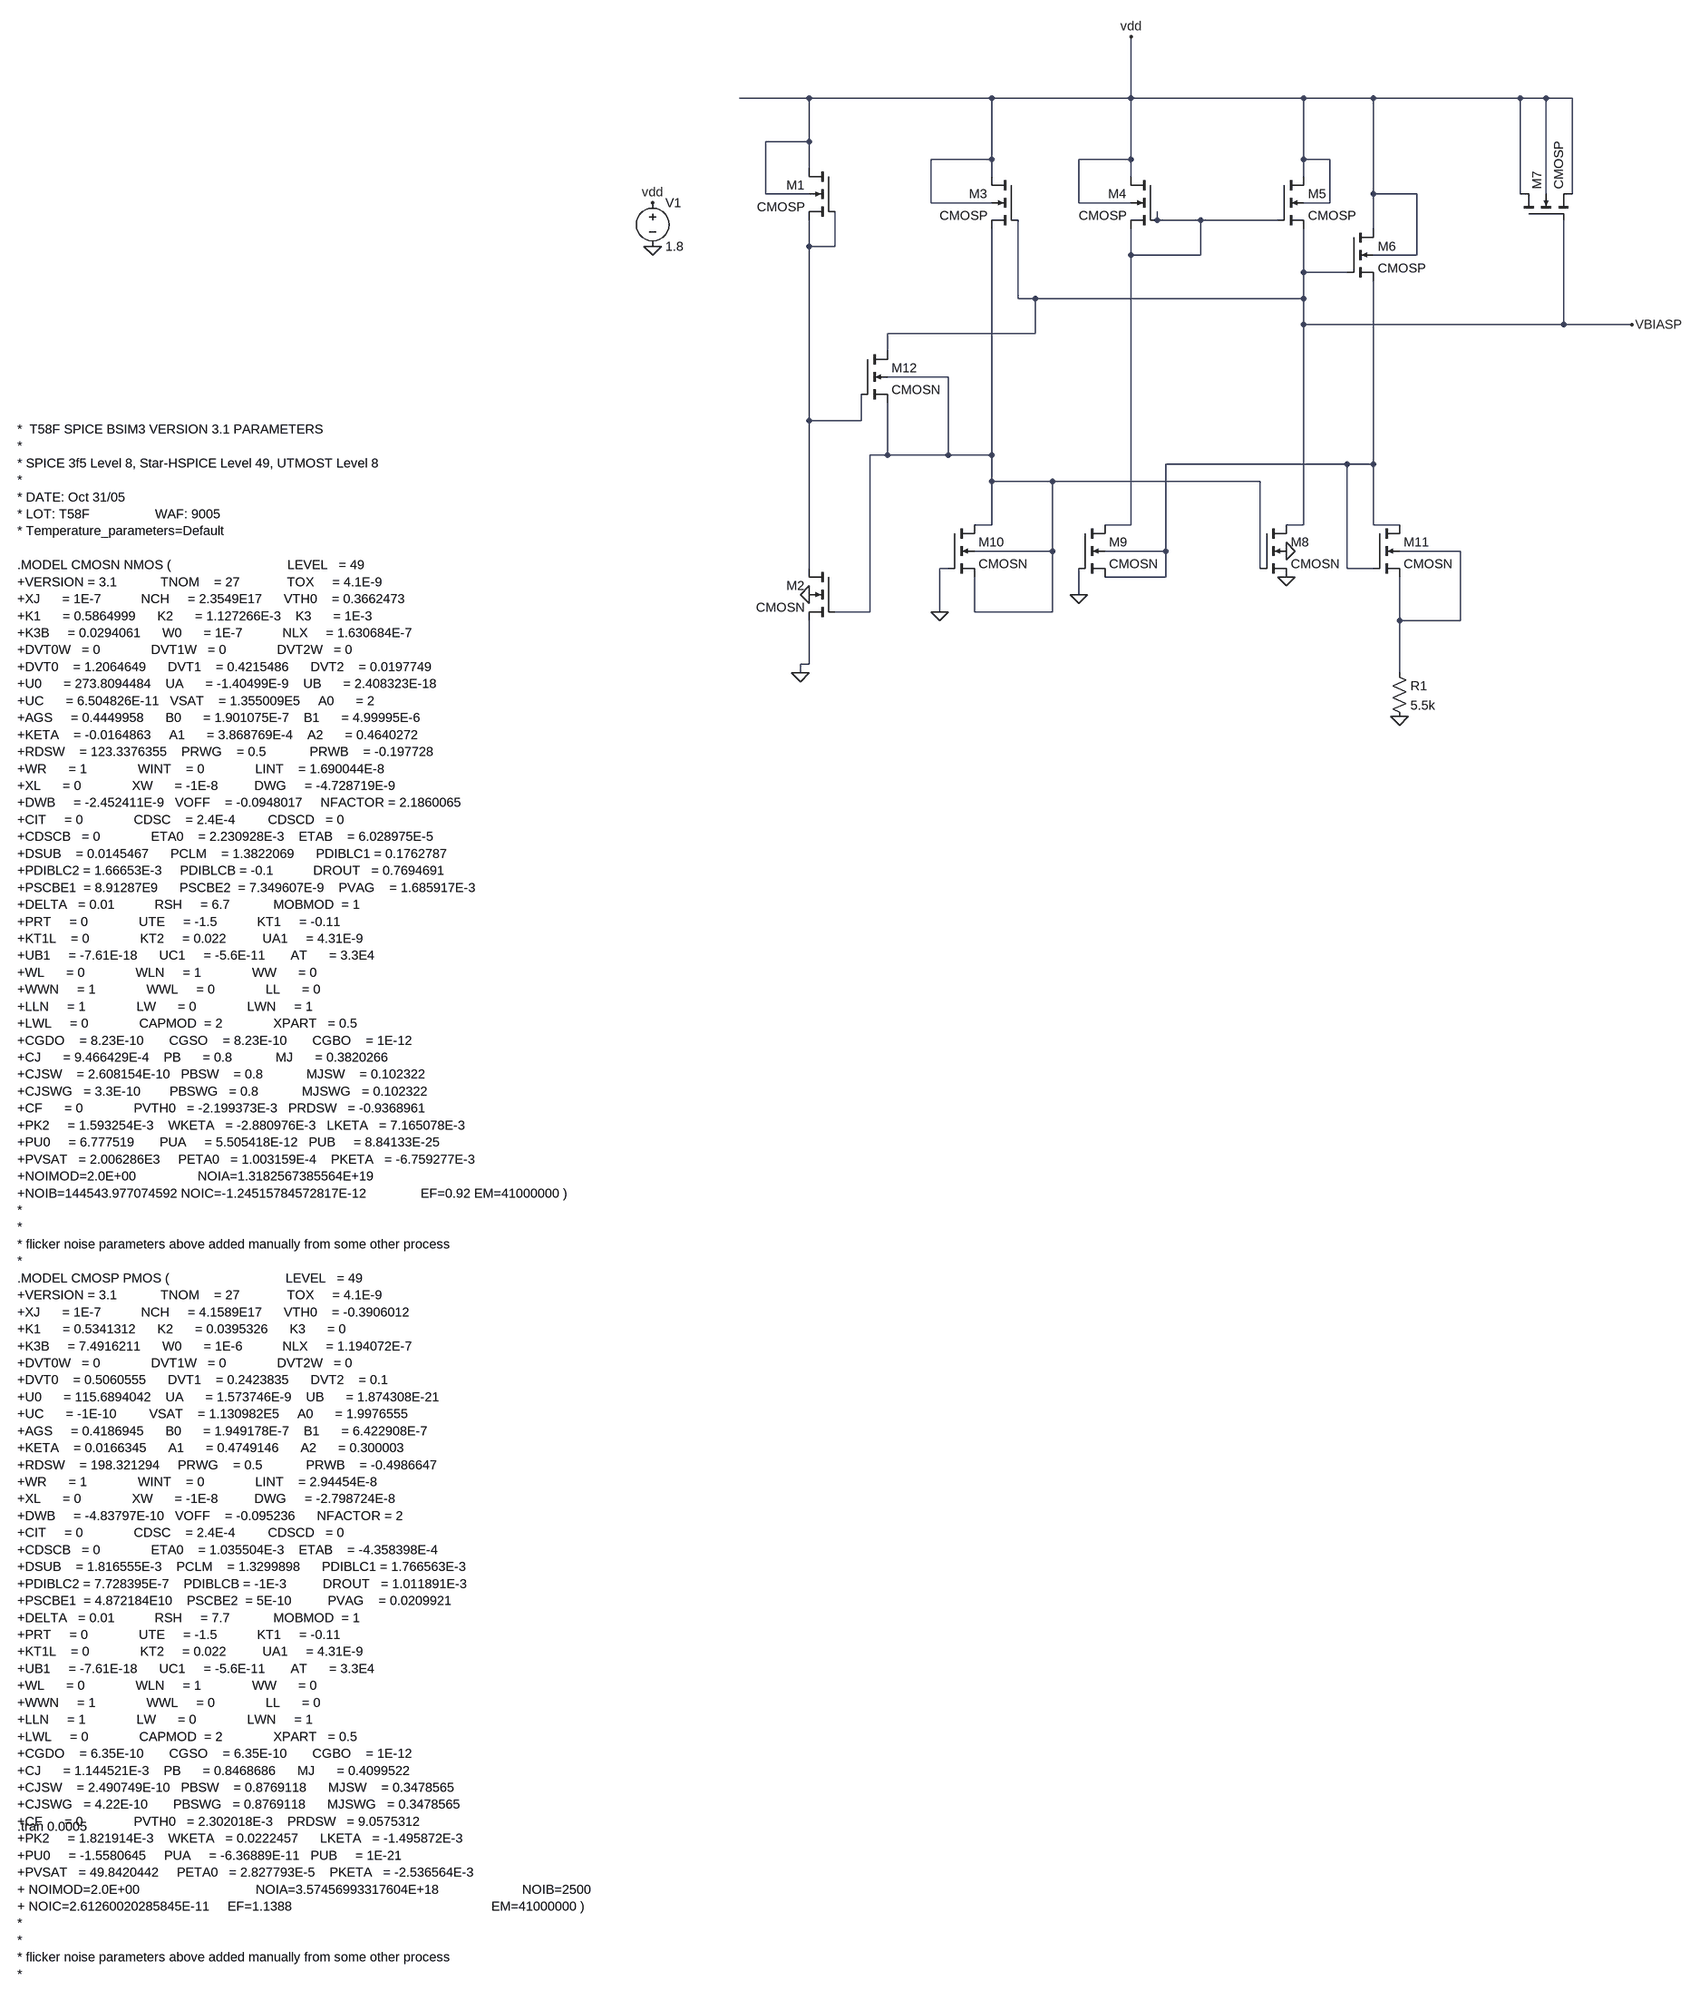
[diagram p0: schematic betamultiply.asc]
betamultiply.asc, the LTspice schematic file:
Version 4
SHEET 1 1480 2616
WIRE -432 -576 -560 -576
WIRE -96 -576 -432 -576
WIRE 160 -576 160 -736
WIRE 160 -576 -96 -576
WIRE 496 -576 160 -576
WIRE 624 -576 496 -576
WIRE 912 -576 624 -576
WIRE 960 -576 912 -576
WIRE 1008 -576 960 -576
WIRE -432 -496 -432 -576
WIRE -432 -496 -512 -496
WIRE -96 -464 -96 -576
WIRE -96 -464 -208 -464
WIRE 160 -464 160 -576
WIRE 160 -464 64 -464
WIRE 496 -464 496 -576
WIRE 544 -464 496 -464
WIRE -432 -448 -432 -496
WIRE -96 -432 -96 -464
WIRE 160 -432 160 -464
WIRE 496 -432 496 -464
WIRE -512 -400 -512 -496
WIRE -432 -400 -512 -400
WIRE 624 -400 624 -576
WIRE 704 -400 624 -400
WIRE 912 -400 912 -576
WIRE 960 -400 960 -576
WIRE 1008 -400 1008 -576
WIRE -208 -384 -208 -464
WIRE -96 -384 -208 -384
WIRE 64 -384 64 -464
WIRE 160 -384 64 -384
WIRE 544 -384 544 -464
WIRE 544 -384 496 -384
WIRE 208 -352 208 -368
WIRE 288 -352 208 -352
WIRE 448 -352 288 -352
WIRE 624 -336 624 -400
WIRE -432 -304 -432 -352
WIRE -384 -304 -384 -368
WIRE -384 -304 -432 -304
WIRE 160 -288 160 -336
WIRE 288 -288 288 -352
WIRE 288 -288 160 -288
WIRE 704 -288 704 -400
WIRE 704 -288 624 -288
WIRE 496 -256 496 -336
WIRE 576 -256 496 -256
WIRE -48 -208 -48 -352
WIRE -16 -208 -48 -208
WIRE 496 -208 496 -256
WIRE 496 -208 -16 -208
WIRE 496 -160 496 -208
WIRE 992 -160 992 -352
WIRE 992 -160 496 -160
WIRE 1376 -160 992 -160
WIRE -16 -144 -16 -208
WIRE -16 -144 -288 -144
WIRE -288 -112 -288 -144
WIRE -176 -64 -288 -64
WIRE -432 16 -432 -304
WIRE -336 16 -336 -32
WIRE -336 16 -432 16
WIRE -288 80 -288 -16
WIRE -288 80 -320 80
WIRE -176 80 -176 -64
WIRE -176 80 -288 80
WIRE -96 80 -96 -336
WIRE -96 80 -176 80
WIRE 576 96 224 96
WIRE 624 96 624 -240
WIRE 624 96 576 96
WIRE -96 128 -96 80
WIRE 16 128 -96 128
WIRE 416 128 16 128
WIRE -96 208 -96 128
WIRE -96 208 -128 208
WIRE 160 208 160 -288
WIRE 160 208 112 208
WIRE 496 208 496 -160
WIRE 496 208 464 208
WIRE 624 208 624 96
WIRE 672 208 624 208
WIRE 16 256 16 128
WIRE 16 256 -128 256
WIRE 224 256 224 96
WIRE 224 256 112 256
WIRE 784 256 672 256
WIRE -432 288 -432 16
WIRE -176 288 -192 288
WIRE 416 288 416 128
WIRE 576 288 576 96
WIRE 624 288 576 288
WIRE 224 304 224 256
WIRE 224 304 112 304
WIRE 64 336 64 288
WIRE -320 368 -320 80
WIRE -320 368 -384 368
WIRE -192 368 -192 288
WIRE -128 368 -128 304
WIRE 16 368 16 256
WIRE 16 368 -128 368
WIRE 672 384 672 304
WIRE 784 384 784 256
WIRE 784 384 672 384
WIRE -432 464 -432 384
WIRE -432 464 -448 464
WIRE -448 480 -448 464
WIRE 672 480 672 384
FLAG 672 560 0
FLAG 464 304 0
FLAG 64 336 0
FLAG -192 368 0
FLAG -448 480 0
FLAG -432 336 0
FLAG -928 -304 0
FLAG -928 -384 vdd
FLAG 1376 -160 VBIASP
FLAG 160 -736 vdd
FLAG 464 256 0
SYMBOL nmos4 -384 -448 M0
SYMATTR InstName M1
SYMATTR Value CMOSP
SYMATTR Value2 l=2u w=24u
SYMBOL nmos4 -384 288 M0
SYMATTR InstName M2
SYMATTR Value CMOSN
SYMATTR Value2 l=2u w=10u
SYMBOL nmos4 -48 -432 M0
SYMATTR InstName M3
SYMATTR Value CMOSP
SYMATTR Value2 l=2u w=24u
SYMBOL nmos4 208 -432 M0
SYMATTR InstName M4
SYMATTR Value CMOSP
SYMATTR Value2 l=2u w=24u
SYMBOL nmos4 448 -432 R0
SYMATTR InstName M5
SYMATTR Value CMOSP
SYMATTR Value2 l=2u w=24u
SYMBOL nmos4 576 -336 R0
SYMATTR InstName M6
SYMATTR Value CMOSP
SYMATTR Value2 l=2u w=24u
SYMBOL nmos4 912 -352 R270
SYMATTR InstName M7
SYMATTR Value CMOSP
SYMATTR Value2 l=2u w=24u
SYMBOL nmos4 416 208 R0
SYMATTR InstName M8
SYMATTR Value CMOSN
SYMATTR Value2 l=2u w=10u
SYMBOL nmos4 64 208 R0
SYMATTR InstName M9
SYMATTR Value CMOSN
SYMATTR Value2 l=2u w=10u
SYMBOL nmos4 -176 208 R0
SYMATTR InstName M10
SYMATTR Value CMOSN
SYMATTR Value2 l=2u w=10u
SYMBOL nmos4 624 208 R0
SYMATTR InstName M11
SYMATTR Value CMOSN
SYMATTR Value2 l=2u w=10u
SYMBOL nmos4 -336 -112 R0
SYMATTR InstName M12
SYMATTR Value CMOSN
SYMATTR Value2 l=2u w=10u
SYMBOL res 656 464 R0
SYMATTR InstName R1
SYMATTR Value 5.5k
SYMBOL voltage -928 -400 R0
WINDOW 123 0 0 Left 0
WINDOW 39 0 0 Left 0
SYMATTR InstName V1
SYMATTR Value 1.8
TEXT -2096 32 Left 2 !*  T58F SPICE BSIM3 VERSION 3.1 PARAMETERS\n* \n* SPICE 3f5 Level 8, Star-HSPICE Level 49, UTMOST Level 8\n* \n* DATE: Oct 31/05\n* LOT: T58F                  WAF: 9005\n* Temperature_parameters=Default\n \n.MODEL CMOSN NMOS (                                LEVEL   = 49\n+VERSION = 3.1            TNOM    = 27             TOX     = 4.1E-9\n+XJ      = 1E-7           NCH     = 2.3549E17      VTH0    = 0.3662473\n+K1      = 0.5864999      K2      = 1.127266E-3    K3      = 1E-3\n+K3B     = 0.0294061      W0      = 1E-7           NLX     = 1.630684E-7\n+DVT0W   = 0              DVT1W   = 0              DVT2W   = 0\n+DVT0    = 1.2064649      DVT1    = 0.4215486      DVT2    = 0.0197749\n+U0      = 273.8094484    UA      = -1.40499E-9    UB      = 2.408323E-18\n+UC      = 6.504826E-11   VSAT    = 1.355009E5     A0      = 2\n+AGS     = 0.4449958      B0      = 1.901075E-7    B1      = 4.99995E-6\n+KETA    = -0.0164863     A1      = 3.868769E-4    A2      = 0.4640272\n+RDSW    = 123.3376355    PRWG    = 0.5            PRWB    = -0.197728\n+WR      = 1              WINT    = 0              LINT    = 1.690044E-8\n+XL      = 0              XW      = -1E-8          DWG     = -4.728719E-9\n+DWB     = -2.452411E-9   VOFF    = -0.0948017     NFACTOR = 2.1860065\n+CIT     = 0              CDSC    = 2.4E-4         CDSCD   = 0\n+CDSCB   = 0              ETA0    = 2.230928E-3    ETAB    = 6.028975E-5\n+DSUB    = 0.0145467      PCLM    = 1.3822069      PDIBLC1 = 0.1762787\n+PDIBLC2 = 1.66653E-3     PDIBLCB = -0.1           DROUT   = 0.7694691\n+PSCBE1  = 8.91287E9      PSCBE2  = 7.349607E-9    PVAG    = 1.685917E-3\n+DELTA   = 0.01           RSH     = 6.7            MOBMOD  = 1\n+PRT     = 0              UTE     = -1.5           KT1     = -0.11\n+KT1L    = 0              KT2     = 0.022          UA1     = 4.31E-9\n+UB1     = -7.61E-18      UC1     = -5.6E-11       AT      = 3.3E4\n+WL      = 0              WLN     = 1              WW      = 0\n+WWN     = 1              WWL     = 0              LL      = 0\n+LLN     = 1              LW      = 0              LWN     = 1\n+LWL     = 0              CAPMOD  = 2              XPART   = 0.5\n+CGDO    = 8.23E-10       CGSO    = 8.23E-10       CGBO    = 1E-12\n+CJ      = 9.466429E-4    PB      = 0.8            MJ      = 0.3820266\n+CJSW    = 2.608154E-10   PBSW    = 0.8            MJSW    = 0.102322\n+CJSWG   = 3.3E-10        PBSWG   = 0.8            MJSWG   = 0.102322\n+CF      = 0              PVTH0   = -2.199373E-3   PRDSW   = -0.9368961\n+PK2     = 1.593254E-3    WKETA   = -2.880976E-3   LKETA   = 7.165078E-3\n+PU0     = 6.777519       PUA     = 5.505418E-12   PUB     = 8.84133E-25\n+PVSAT   = 2.006286E3     PETA0   = 1.003159E-4    PKETA   = -6.759277E-3\n+NOIMOD=2.0E+00                 NOIA=1.3182567385564E+19\n+NOIB=144543.977074592 NOIC=-1.24515784572817E-12               EF=0.92 EM=41000000 )\n*\n*\n* flicker noise parameters above added manually from some other process\n* \n.MODEL CMOSP PMOS (                                LEVEL   = 49\n+VERSION = 3.1            TNOM    = 27             TOX     = 4.1E-9\n+XJ      = 1E-7           NCH     = 4.1589E17      VTH0    = -0.3906012\n+K1      = 0.5341312      K2      = 0.0395326      K3      = 0\n+K3B     = 7.4916211      W0      = 1E-6           NLX     = 1.194072E-7\n+DVT0W   = 0              DVT1W   = 0              DVT2W   = 0\n+DVT0    = 0.5060555      DVT1    = 0.2423835      DVT2    = 0.1\n+U0      = 115.6894042    UA      = 1.573746E-9    UB      = 1.874308E-21\n+UC      = -1E-10         VSAT    = 1.130982E5     A0      = 1.9976555\n+AGS     = 0.4186945      B0      = 1.949178E-7    B1      = 6.422908E-7\n+KETA    = 0.0166345      A1      = 0.4749146      A2      = 0.300003\n+RDSW    = 198.321294     PRWG    = 0.5            PRWB    = -0.4986647\n+WR      = 1              WINT    = 0              LINT    = 2.94454E-8\n+XL      = 0              XW      = -1E-8          DWG     = -2.798724E-8\n+DWB     = -4.83797E-10   VOFF    = -0.095236      NFACTOR = 2\n+CIT     = 0              CDSC    = 2.4E-4         CDSCD   = 0\n+CDSCB   = 0              ETA0    = 1.035504E-3    ETAB    = -4.358398E-4\n+DSUB    = 1.816555E-3    PCLM    = 1.3299898      PDIBLC1 = 1.766563E-3\n+PDIBLC2 = 7.728395E-7    PDIBLCB = -1E-3          DROUT   = 1.011891E-3\n+PSCBE1  = 4.872184E10    PSCBE2  = 5E-10          PVAG    = 0.0209921\n+DELTA   = 0.01           RSH     = 7.7            MOBMOD  = 1\n+PRT     = 0              UTE     = -1.5           KT1     = -0.11\n+KT1L    = 0              KT2     = 0.022          UA1     = 4.31E-9\n+UB1     = -7.61E-18      UC1     = -5.6E-11       AT      = 3.3E4\n+WL      = 0              WLN     = 1              WW      = 0\n+WWN     = 1              WWL     = 0              LL      = 0\n+LLN     = 1              LW      = 0              LWN     = 1\n+LWL     = 0              CAPMOD  = 2              XPART   = 0.5\n+CGDO    = 6.35E-10       CGSO    = 6.35E-10       CGBO    = 1E-12\n+CJ      = 1.144521E-3    PB      = 0.8468686      MJ      = 0.4099522\n+CJSW    = 2.490749E-10   PBSW    = 0.8769118      MJSW    = 0.3478565\n+CJSWG   = 4.22E-10       PBSWG   = 0.8769118      MJSWG   = 0.3478565\n+CF      = 0              PVTH0   = 2.302018E-3    PRDSW   = 9.0575312\n+PK2     = 1.821914E-3    WKETA   = 0.0222457      LKETA   = -1.495872E-3\n+PU0     = -1.5580645     PUA     = -6.36889E-11   PUB     = 1E-21\n+PVSAT   = 49.8420442     PETA0   = 2.827793E-5    PKETA   = -2.536564E-3 \n+ NOIMOD=2.0E+00                                NOIA=3.57456993317604E+18                       NOIB=2500\n+ NOIC=2.61260020285845E-11     EF=1.1388                                                       EM=41000000 )\n*\n*\n* flicker noise parameters above added manually from some other process\n*
TEXT -2096 2600 Left 2 !.tran 0.0005

The netlist it stands for:
* betamultiply.asc
M1 vdd N002 N002 vdd CMOSP l=2u w=24u
M2 N002 N003 0 0 CMOSN l=2u w=10u
M3 vdd VBIASP N003 vdd CMOSP l=2u w=24u
M4 vdd N001 N001 vdd CMOSP l=2u w=24u
M5 vdd N001 VBIASP vdd CMOSP l=2u w=24u
M6 vdd VBIASP N004 vdd CMOSP l=2u w=24u
M7 vdd VBIASP vdd vdd CMOSP l=2u w=24u
M8 VBIASP N003 0 0 CMOSN l=2u w=10u
M9 N001 0 N004 N004 CMOSN l=2u w=10u
M10 N003 0 N003 N003 CMOSN l=2u w=10u
M11 N004 N004 N005 N005 CMOSN l=2u w=10u
M12 VBIASP N002 N003 N003 CMOSN l=2u w=10u
R1 N005 0 5.5k
V1 vdd 0 1.8
.model NMOS NMOS
.model PMOS PMOS
.lib standard.mos
*  T58F SPICE BSIM3 VERSION 3.1 PARAMETERS
*
* SPICE 3f5 Level 8, Star-HSPICE Level 49, UTMOST Level 8
*
* DATE: Oct 31/05
* LOT: T58F                  WAF: 9005
* Temperature_parameters=Default
.MODEL CMOSN NMOS (                                LEVEL   = 49
+VERSION = 3.1            TNOM    = 27             TOX     = 4.1E-9
+XJ      = 1E-7           NCH     = 2.3549E17      VTH0    = 0.3662473
+K1      = 0.5864999      K2      = 1.127266E-3    K3      = 1E-3
+K3B     = 0.0294061      W0      = 1E-7           NLX     = 1.630684E-7
+DVT0W   = 0              DVT1W   = 0              DVT2W   = 0
+DVT0    = 1.2064649      DVT1    = 0.4215486      DVT2    = 0.0197749
+U0      = 273.8094484    UA      = -1.40499E-9    UB      = 2.408323E-18
+UC      = 6.504826E-11   VSAT    = 1.355009E5     A0      = 2
+AGS     = 0.4449958      B0      = 1.901075E-7    B1      = 4.99995E-6
+KETA    = -0.0164863     A1      = 3.868769E-4    A2      = 0.4640272
+RDSW    = 123.3376355    PRWG    = 0.5            PRWB    = -0.197728
+WR      = 1              WINT    = 0              LINT    = 1.690044E-8
+XL      = 0              XW      = -1E-8          DWG     = -4.728719E-9
+DWB     = -2.452411E-9   VOFF    = -0.0948017     NFACTOR = 2.1860065
+CIT     = 0              CDSC    = 2.4E-4         CDSCD   = 0
+CDSCB   = 0              ETA0    = 2.230928E-3    ETAB    = 6.028975E-5
+DSUB    = 0.0145467      PCLM    = 1.3822069      PDIBLC1 = 0.1762787
+PDIBLC2 = 1.66653E-3     PDIBLCB = -0.1           DROUT   = 0.7694691
+PSCBE1  = 8.91287E9      PSCBE2  = 7.349607E-9    PVAG    = 1.685917E-3
+DELTA   = 0.01           RSH     = 6.7            MOBMOD  = 1
+PRT     = 0              UTE     = -1.5           KT1     = -0.11
+KT1L    = 0              KT2     = 0.022          UA1     = 4.31E-9
+UB1     = -7.61E-18      UC1     = -5.6E-11       AT      = 3.3E4
+WL      = 0              WLN     = 1              WW      = 0
+WWN     = 1              WWL     = 0              LL      = 0
+LLN     = 1              LW      = 0              LWN     = 1
+LWL     = 0              CAPMOD  = 2              XPART   = 0.5
+CGDO    = 8.23E-10       CGSO    = 8.23E-10       CGBO    = 1E-12
+CJ      = 9.466429E-4    PB      = 0.8            MJ      = 0.3820266
+CJSW    = 2.608154E-10   PBSW    = 0.8            MJSW    = 0.102322
+CJSWG   = 3.3E-10        PBSWG   = 0.8            MJSWG   = 0.102322
+CF      = 0              PVTH0   = -2.199373E-3   PRDSW   = -0.9368961
+PK2     = 1.593254E-3    WKETA   = -2.880976E-3   LKETA   = 7.165078E-3
+PU0     = 6.777519       PUA     = 5.505418E-12   PUB     = 8.84133E-25
+PVSAT   = 2.006286E3     PETA0   = 1.003159E-4    PKETA   = -6.759277E-3
+NOIMOD=2.0E+00                 NOIA=1.3182567385564E+19
+NOIB=144543.977074592 NOIC=-1.24515784572817E-12               EF=0.92 EM=41000000 )
*
*
* flicker noise parameters above added manually from some other process
*
.MODEL CMOSP PMOS (                                LEVEL   = 49
+VERSION = 3.1            TNOM    = 27             TOX     = 4.1E-9
+XJ      = 1E-7           NCH     = 4.1589E17      VTH0    = -0.3906012
+K1      = 0.5341312      K2      = 0.0395326      K3      = 0
+K3B     = 7.4916211      W0      = 1E-6           NLX     = 1.194072E-7
+DVT0W   = 0              DVT1W   = 0              DVT2W   = 0
+DVT0    = 0.5060555      DVT1    = 0.2423835      DVT2    = 0.1
+U0      = 115.6894042    UA      = 1.573746E-9    UB      = 1.874308E-21
+UC      = -1E-10         VSAT    = 1.130982E5     A0      = 1.9976555
+AGS     = 0.4186945      B0      = 1.949178E-7    B1      = 6.422908E-7
+KETA    = 0.0166345      A1      = 0.4749146      A2      = 0.300003
+RDSW    = 198.321294     PRWG    = 0.5            PRWB    = -0.4986647
+WR      = 1              WINT    = 0              LINT    = 2.94454E-8
+XL      = 0              XW      = -1E-8          DWG     = -2.798724E-8
+DWB     = -4.83797E-10   VOFF    = -0.095236      NFACTOR = 2
+CIT     = 0              CDSC    = 2.4E-4         CDSCD   = 0
+CDSCB   = 0              ETA0    = 1.035504E-3    ETAB    = -4.358398E-4
+DSUB    = 1.816555E-3    PCLM    = 1.3299898      PDIBLC1 = 1.766563E-3
+PDIBLC2 = 7.728395E-7    PDIBLCB = -1E-3          DROUT   = 1.011891E-3
+PSCBE1  = 4.872184E10    PSCBE2  = 5E-10          PVAG    = 0.0209921
+DELTA   = 0.01           RSH     = 7.7            MOBMOD  = 1
+PRT     = 0              UTE     = -1.5           KT1     = -0.11
+KT1L    = 0              KT2     = 0.022          UA1     = 4.31E-9
+UB1     = -7.61E-18      UC1     = -5.6E-11       AT      = 3.3E4
+WL      = 0              WLN     = 1              WW      = 0
+WWN     = 1              WWL     = 0              LL      = 0
+LLN     = 1              LW      = 0              LWN     = 1
+LWL     = 0              CAPMOD  = 2              XPART   = 0.5
+CGDO    = 6.35E-10       CGSO    = 6.35E-10       CGBO    = 1E-12
+CJ      = 1.144521E-3    PB      = 0.8468686      MJ      = 0.4099522
+CJSW    = 2.490749E-10   PBSW    = 0.8769118      MJSW    = 0.3478565
+CJSWG   = 4.22E-10       PBSWG   = 0.8769118      MJSWG   = 0.3478565
+CF      = 0              PVTH0   = 2.302018E-3    PRDSW   = 9.0575312
+PK2     = 1.821914E-3    WKETA   = 0.0222457      LKETA   = -1.495872E-3
+PU0     = -1.5580645     PUA     = -6.36889E-11   PUB     = 1E-21
+PVSAT   = 49.8420442     PETA0   = 2.827793E-5    PKETA   = -2.536564E-3
+ NOIMOD=2.0E+00                                NOIA=3.57456993317604E+18                       NOIB=2500
+ NOIC=2.61260020285845E-11     EF=1.1388                                                       EM=41000000 )
*
*
* flicker noise parameters above added manually from some other process
*
.tran 0.0005
.backanno
.end